# Altium project DB.PRJPCB
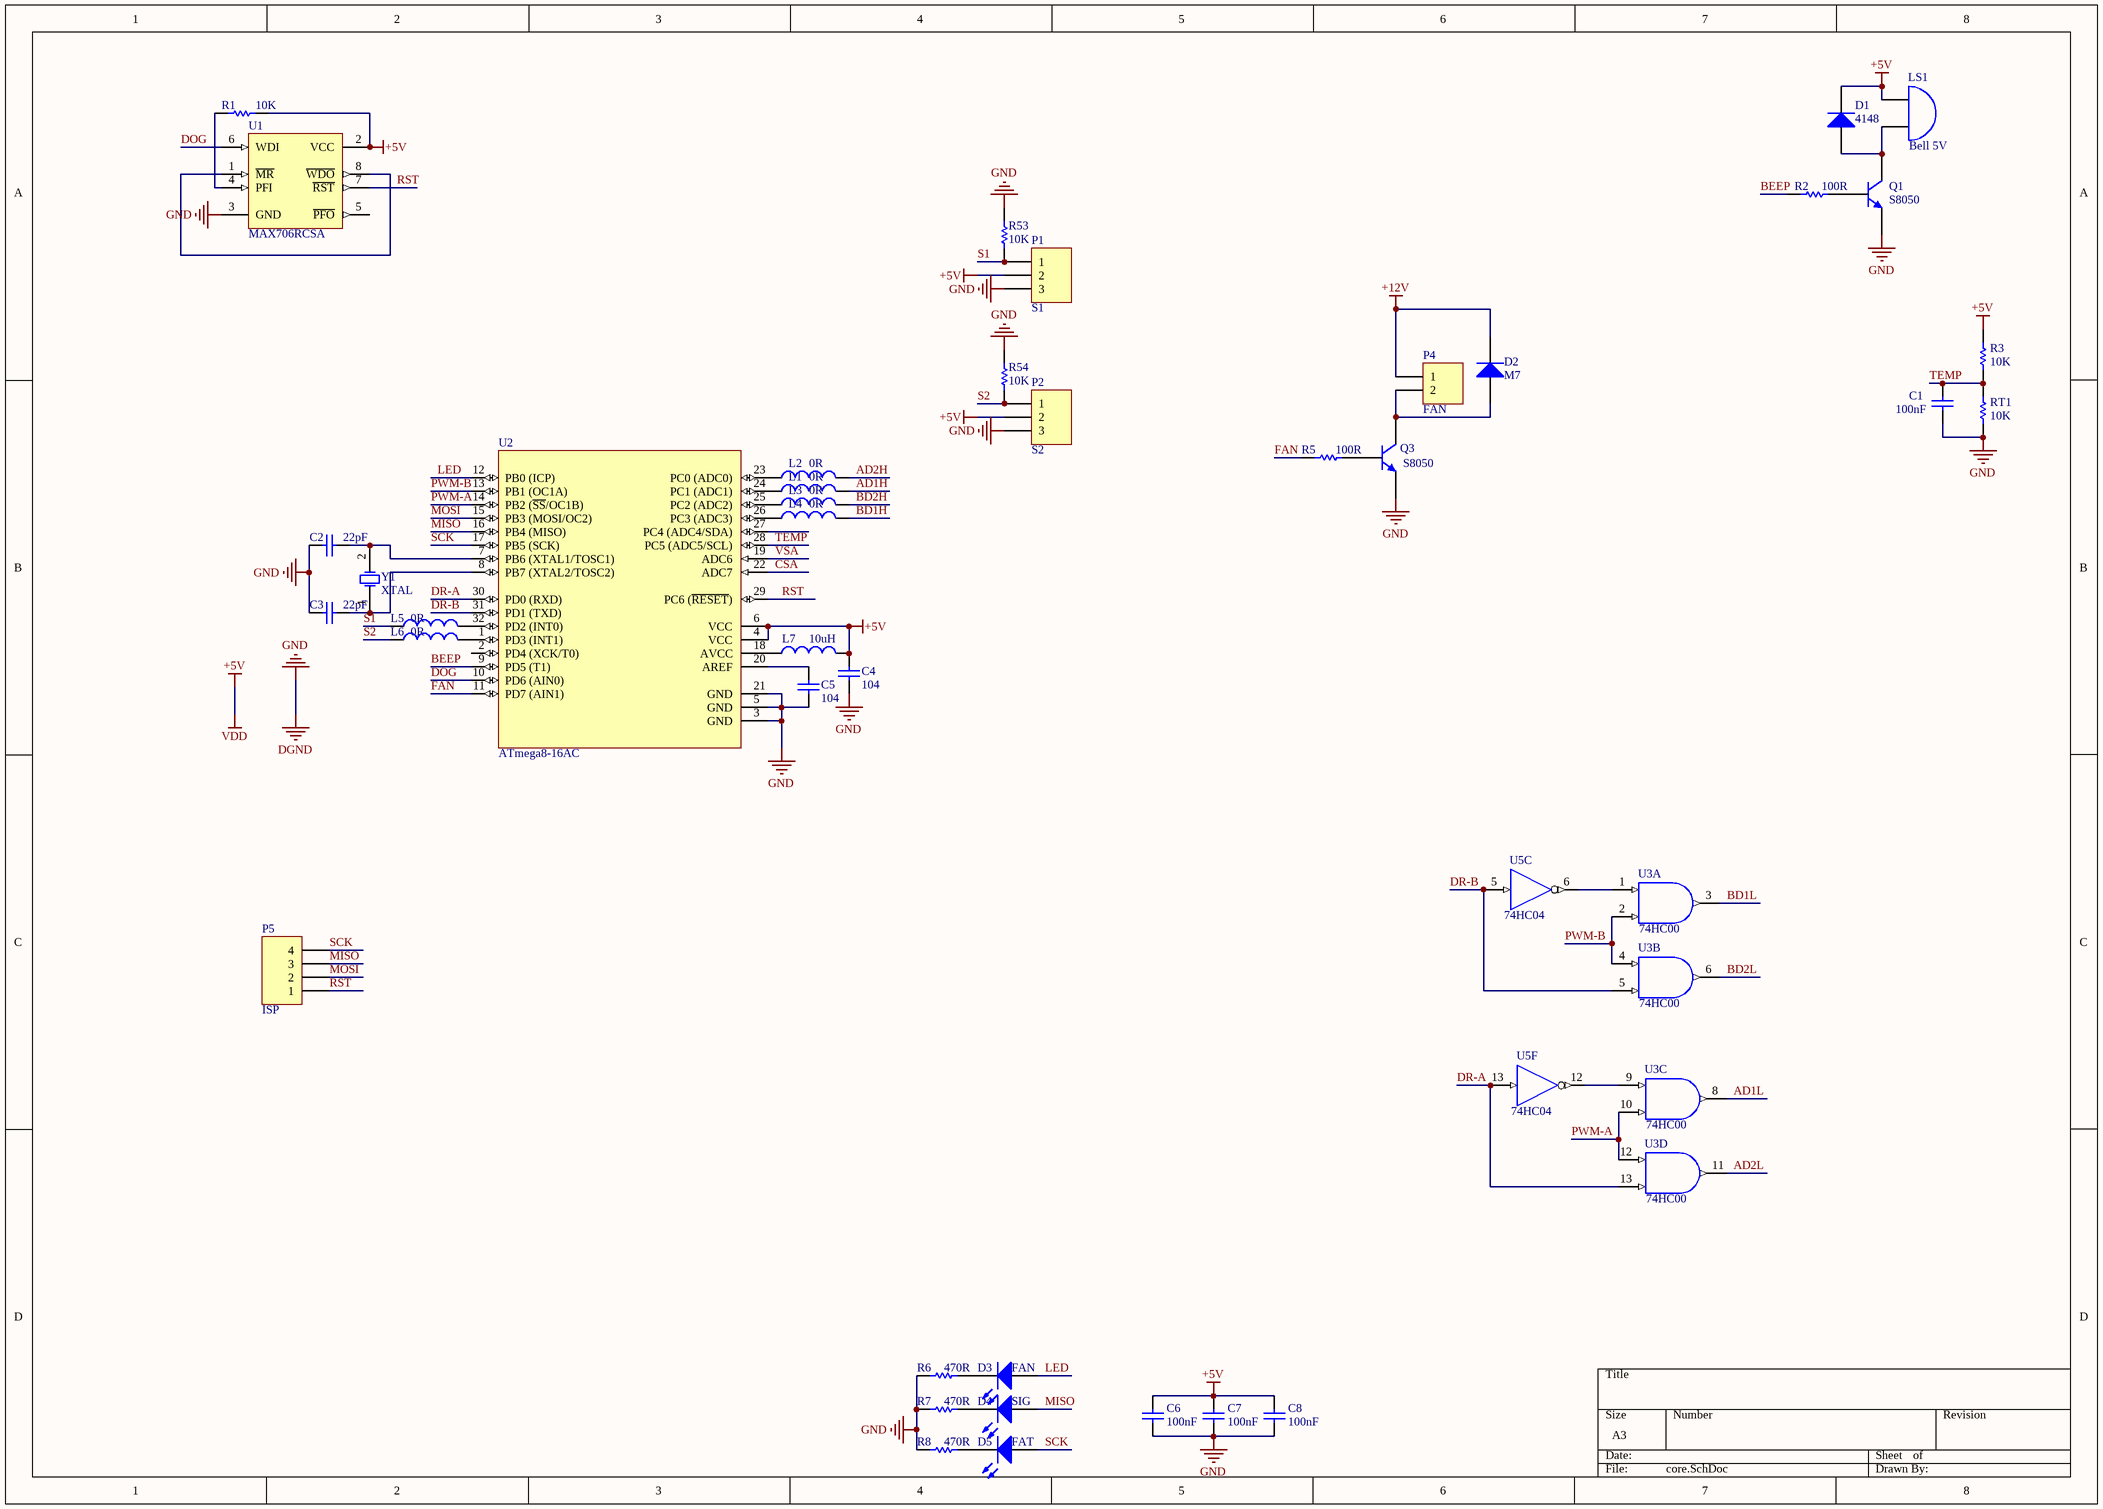
[diagram p0: core.SchDoc]
2 sheets, 151 parts. Net scope: global (net labels, ports and power ports of the same name join across sheets).
Board file: db.PcbDoc
Sheets:
  core.SchDoc
  drive.SchDoc

## Sheet core.SchDoc
size A3

### Parts
C1  value 100nF  [0603]  (hidden comment: Cap)
C2  value 22pF  [0603]  (hidden comment: Cap)
C3  value 22pF  [0603]  (hidden comment: Cap)
C4  value 104  [0603]  (hidden comment: Cap)
C5  value 104  [0603]  (hidden comment: Cap)
C6  value 100nF  [0603]  (hidden comment: Cap)
C7  value 100nF  [0603]  (hidden comment: Cap)
C8  value 100nF  [0603]  (hidden comment: Cap)
D1  4148  [LL34]
D2  value M7  [SMA]  (hidden comment: Diode)
D3  FAN  [0603-LED]
D4  SIG  [0603-LED]
D5  FAT  [0603-LED]
L1  value 0R  [0603]  (hidden comment: Inductor)
L2  value 0R  [0603]  (hidden comment: Inductor)
L3  value 0R  [0603]  (hidden comment: Inductor)
L4  value 0R  [0603]  (hidden comment: Inductor)
L5  value 0R  [0603]  (hidden comment: Inductor)
L6  value 0R  [0603]  (hidden comment: Inductor)
L7  value 10uH  [0603]  (hidden comment: Inductor)
LS1  value Bell 5V  [BEEP-9x5.5]  (hidden comment: Bell)
P1  S1  [HDR1X3]
P2  S2  [HDR1X3]
P4  FAN  [XH2.54-2P]
P5  ISP  [HDR1X4]
Q1  value S8050  [SOT-23-NPN]  (hidden comment: NPN)
Q3  value S8050  [SOT-23-NPN]  (hidden comment: NPN)
R1  value 10K  [0603]  (hidden comment: Res1)
R2  value 100R  [0603]  (hidden comment: Res1)
R3  value 10K  [0603]  (hidden comment: Res1)
R5  value 100R  [0603]  (hidden comment: Res1)
R6  value 470R  [0603]  (hidden comment: Res1)
R7  value 470R  [0603]  (hidden comment: Res1)
R8  value 470R  [0603]  (hidden comment: Res1)
R53  value 10K  [0603]  (hidden comment: Res1)
R54  value 10K  [0603]  (hidden comment: Res1)
RT1  value 10K  [RT-2.0]  (hidden comment: Res1)
U1  MAX706RCSA  [SOIC8]
U2  ATmega8-16AC  [32A_M]
U3  value 74HC00  [751A]  (hidden comment: IC)  (parts A,B,C,D of 4)
U5  value 74HC04  [751A]  (hidden comment: IC)  (parts C,F of 6)
Y1  XTAL  [49SD]

### Nets
+5V: C4.1 C6.2 C7.2 C8.2 D1.2(K) L7.2 LS1.1(A) P1.2 P2.2 R1.2 R3.2 U1.2(VCC) U2.4(VCC) U2.6(VCC) U3.14(VDD) U5.14(VDD)  [also labelled VDD]
+12V: D2.2(K) P4.1
DGND: C1.1 C2.2 C3.2 C4.2 C5.2 C6.1 C7.1 C8.1 P1.3 P2.3 Q1.1(E) Q3.1(E) R6.2 R7.2 R8.2 R53.2 R54.2 RT1.1 U1.3(GND) U2.3(GND) U2.5(GND) U2.21(GND) U3.7(GND) U5.7(GND)  [also labelled GND]
AD1H: L1.2
AD1L: U3.8(Y)
AD2H: L2.2
AD2L: U3.11(Y)
BD1H: L4.2
BD1L: U3.3(Y)
BD2H: L3.2
BD2L: U3.6(Y)
BEEP: R2.2 U2.9(PD5_(T1))
CSA: U2.22(ADC7)
DOG: U1.6(WDI) U2.10(PD6_(AIN0))
DR-A: U2.30(PD0_(RXD)) U3.13(B) U5.13(A)
DR-B: U2.31(PD1_(TXD)) U3.5(B) U5.5(A)
FAN: R5.1 U2.11(PD7_(AIN1))
LED: D3.1(A) U2.12(PB0_(ICP))
MISO: D4.1(A) P5.3 U2.16(PB4_(MISO))
MOSI: P5.2 U2.15(PB3_(MOSI/OC2))
PWM-A: U2.14(PB2_(~{SS}/OC1B)) U3.10(B) U3.12(A)
PWM-B: U2.13(PB1_(OC1A)) U3.2(B) U3.4(A)
RST: P5.1 U1.7(~{RST}) U2.29(PC6_(~{RESET}))
S1: L5.1 P1.1 R53.1
S2: L6.1 P2.1 R54.1
SCK: D5.1(A) P5.4 U2.17(PB5_(SCK))
TEMP: C1.2 R3.1 RT1.2 U2.28(PC5_(ADC5/SCL))
VSA: U2.19(ADC6)
NetC2_1: C2.1 U2.7(PB6_(XTAL1/TOSC1)) Y1.2(OSC2)
NetC3_1: C3.1 U2.8(PB7_(XTAL2/TOSC2)) Y1.1(OSC1)
NetC5_1: C5.1 U2.20(AREF)
NetD1_1: D1.1(A) LS1.2(B) Q1.3(C)
NetD2_1: D2.1(A) P4.2 Q3.3(C)
NetD3_2: D3.2(K) R6.1
NetD4_2: D4.2(K) R7.1
NetD5_2: D5.2(K) R8.1
NetL1_1: L1.1 U2.24(PC1_(ADC1))
NetL2_1: L2.1 U2.23(PC0_(ADC0))
NetL3_1: L3.1 U2.25(PC2_(ADC2))
NetL4_1: L4.1 U2.26(PC3_(ADC3))
NetL5_2: L5.2 U2.32(PD2_(INT0))
NetL6_2: L6.2 U2.1(PD3_(INT1))
NetL7_1: L7.1 U2.18(AVCC)
NetQ1_2: Q1.2(B) R2.1
NetQ3_2: Q3.2(B) R5.2
NetR1_1: R1.1 U1.4(PFI)
NetU1_1: U1.1(~{MR}) U1.8(~{WDO})
NetU3_1: U3.1(A) U5.6(Y)
NetU3_9: U3.9(A) U5.12(Y)

Not connected (* = marked no-connect by the designer): U1 5(~{PFO}); U2 2(PD4_(XCK/T0)) 27(PC4_(ADC4/SDA))

### Library data of the parts
C1-C8 = Cap: Capacitor; Published: 8-Jun-2000; LatestRevisionDate: 17-Jul-2002; LatestRevisionNote: Re-released for DXP Platform.; PackageReference: RAD-0.3; Publisher: Altium Limited
D1 = Diode 1N5408: 3 Amp Medium Power Silicon Rectifier Diode; Value: 1N4148; Published: 8-Jun-2000; LatestRevisionDate: 17-Jul-2002; LatestRevisionNote: Re-released for DXP Platform.; DatasheetDocument: Aug-1984; PackageReference: DO-201AD; Publisher: Altium Limited; ComponentLink1Description: Manufacturer Link; ComponentLink1URL: http://www.irf.com/
D2 = Diode 1N4007: 1 Amp General Purpose Rectifier; Published: 8-Jun-2000; LatestRevisionDate: 17-Jul-2002; LatestRevisionNote: Re-released for DXP Platform.; DatasheetDocument: 1998; PackageDocument: Aug-1999; PackageReference: DO-41; Publisher: Altium Limited; Code_JEDEC: DO-204-AL; ComponentLink1Description: Manufacturer Link; ComponentLink1URL: http://www.fairchildsemi.com/; ComponentLink2Description: Datasheet; ComponentLink2URL: http://www.fairchildsemi.com/ds/1N%2F1N4001.pdf
D3-D5 = LED2: Typical RED, GREEN, YELLOW, AMBER GaAs LED; Published: 8-Jun-2000; LatestRevisionDate: 17-Jul-2002; LatestRevisionNote: Re-released for DXP Platform.; PackageDocument: Feb-2002; PackageReference: 3.2X1.6X1.1; Publisher: Altium Limited; Value: RED
L1-L7 = Inductor: Code_IEC: 1005; Published: 8-Jun-2000; LatestRevisionDate: 17-Jul-2002; LatestRevisionNote: Re-released for DXP Platform.; PackageReference: 0402-A; Publisher: Altium Limited; Code_JEITA: 0402
LS1 = Bell: Electrical Bell; pin to pad: 1>2 2>1; Published: 24-Mar-1999; LatestRevisionDate: 17-Jul-2002; LatestRevisionNote: Re-released for DXP Platform.; PackageReference: PIN2; Publisher: Altium Limited
P1 P2 = Header 3: Header, 3-Pin; LatestRevisionDate: 17-Jul-2002; LatestRevisionNote: Re-released for DXP Platform.; Publisher: Altium Limited
P4 = Header 2: Header, 2-Pin; Value: XH2.54-2P; LatestRevisionDate: 17-Jul-2002; LatestRevisionNote: Re-released for DXP Platform.; Publisher: Altium Limited
P5 = Header 4: Header, 4-Pin; LatestRevisionDate: 17-Jul-2002; LatestRevisionNote: Re-released for DXP Platform.; Publisher: Altium Limited
Q1 Q3 = 2N5551: NPN General Purpose Amplifier; Published: 8-Jun-2000; LatestRevisionDate: 17-Jan-2003; LatestRevisionNote: PCB Footprint 'BCY-W3/D4.7' replaced; DatasheetDocument: 1997; PackageDocument: Sep-1998; PackageReference: TO-92A; Publisher: Altium Limited; ComponentLink1Description: Manufacturer Link; ComponentLink1URL: http://www.fairchildsemi.com/; ComponentLink2Description: Datasheet; ComponentLink2URL: http://www.fairchildsemi.com/ds/2N%2F2N5551.pdf
R1-R3 R5-R8 R53 R54 RT1 = Res1: Resistor; Published: 8-Jun-2000; LatestRevisionDate: 17-Jul-2002; LatestRevisionNote: Re-released for DXP Platform.; PackageReference: AXIAL-0.3; Publisher: Altium Limited
U1 = MAX706RCSA: +3V Voltage Monitoring, Low-Cost, µP Supervisory Circuit; Published: 16-Jan-2001; LatestRevisionDate: 13-Apr-2006; LatestRevisionNote: IPC-7351 Footprint Added.; DatasheetVersion: Sep-1995; PackageReference: NSO8; Publisher: Altium Limited; PackageDescription: 8-Pin Small Outline Integrated Circuit 1.27 mm Pitch; Code_JEDEC: MS-012-AA; Code_IPC: SOIC127P600-8; ComponentLink1Description: Manufacturer Link; ComponentLink1URL: http://www.maxim-ic.com/; ComponentLink2Description: Datasheet; ComponentLink2URL: http://pdfserv.maxim-ic.com/en/ds/MAX706P-MAX708T.pdf
U2 = ATmega8-16AC: 8-Bit AVR Microcontroller with 8K Bytes of In-System Programmable Flash Memory; Published: 17-Sep-2003; LatestRevisionDate: 13-Apr-2006; LatestRevisionNote: IPC-7351 Footprint Added.; DatasheetVersion: 2486H-AVR-09/02; PackageVersion: revB, Oct-2001; PackageReference: 32A; Publisher: Altium Limited; PackageDescription: 32-Pin Thin Quad Flat Pack 0.8 mm Pitch; Code_JEDEC: MS-026-ABA; ComponentLink1Description: Manufacturer Link; ComponentLink1URL: http://www.atmel.com; ComponentLink2Description: Datasheet; ComponentLink2URL: http://www.atmel.com/dyn/resources/prod_documents/doc2486.pdf
U3 = MC74HC08AD: Quad 2-Input AND Gate; Published: 17-Jul-2002; LatestRevisionDate: 13-Apr-2006; LatestRevisionNote: IPC-7351 Footprint Added.; DatasheetVersion: 1989; PackageVersion: 1991; PackageReference: 751A-02; Publisher: Altium Limited; PackageDescription: 14-Pin Small Outline Integrated Circuit 1.27 mm Pitch; Code_IPC: SOIC127P600-14; ComponentLink1Description: Manufacturer Link; ComponentLink1URL: http://www.onsemi.com/site/products/parametrics/0,4446,247,00.html; ComponentLink2Description: Ibis Model; ComponentLink2URL: http://www.onsemi.com/pub/Collateral/MC54HC08AJ.IBS
U5 = MC74HC04AD: Hex Inverter; Published: 17-Jul-2002; LatestRevisionDate: 13-Apr-2006; LatestRevisionNote: IPC-7351 Footprint Added.; DatasheetVersion: 1989; PackageVersion: 1991; PackageReference: 751A-02; Publisher: Altium Limited; PackageDescription: 14-Pin Small Outline Integrated Circuit 1.27 mm Pitch; Code_IPC: SOIC127P600-14; ComponentLink1Description: Manufacturer Link; ComponentLink1URL: http://www.onsemi.com/site/products/parametrics/0,4446,247,00.html; ComponentLink2Description: Ibis Model; ComponentLink2URL: http://www.onsemi.com/pub/Collateral/MC54HC04AJ.IBS
Y1 = XTAL: Crystal Oscillator; Published: 8-Jun-2000; LatestRevisionDate: 17-Jul-2002; LatestRevisionNote: Re-released for DXP Platform.; PackageReference: R38; Publisher: Altium Limited

## Sheet drive.SchDoc
size A3
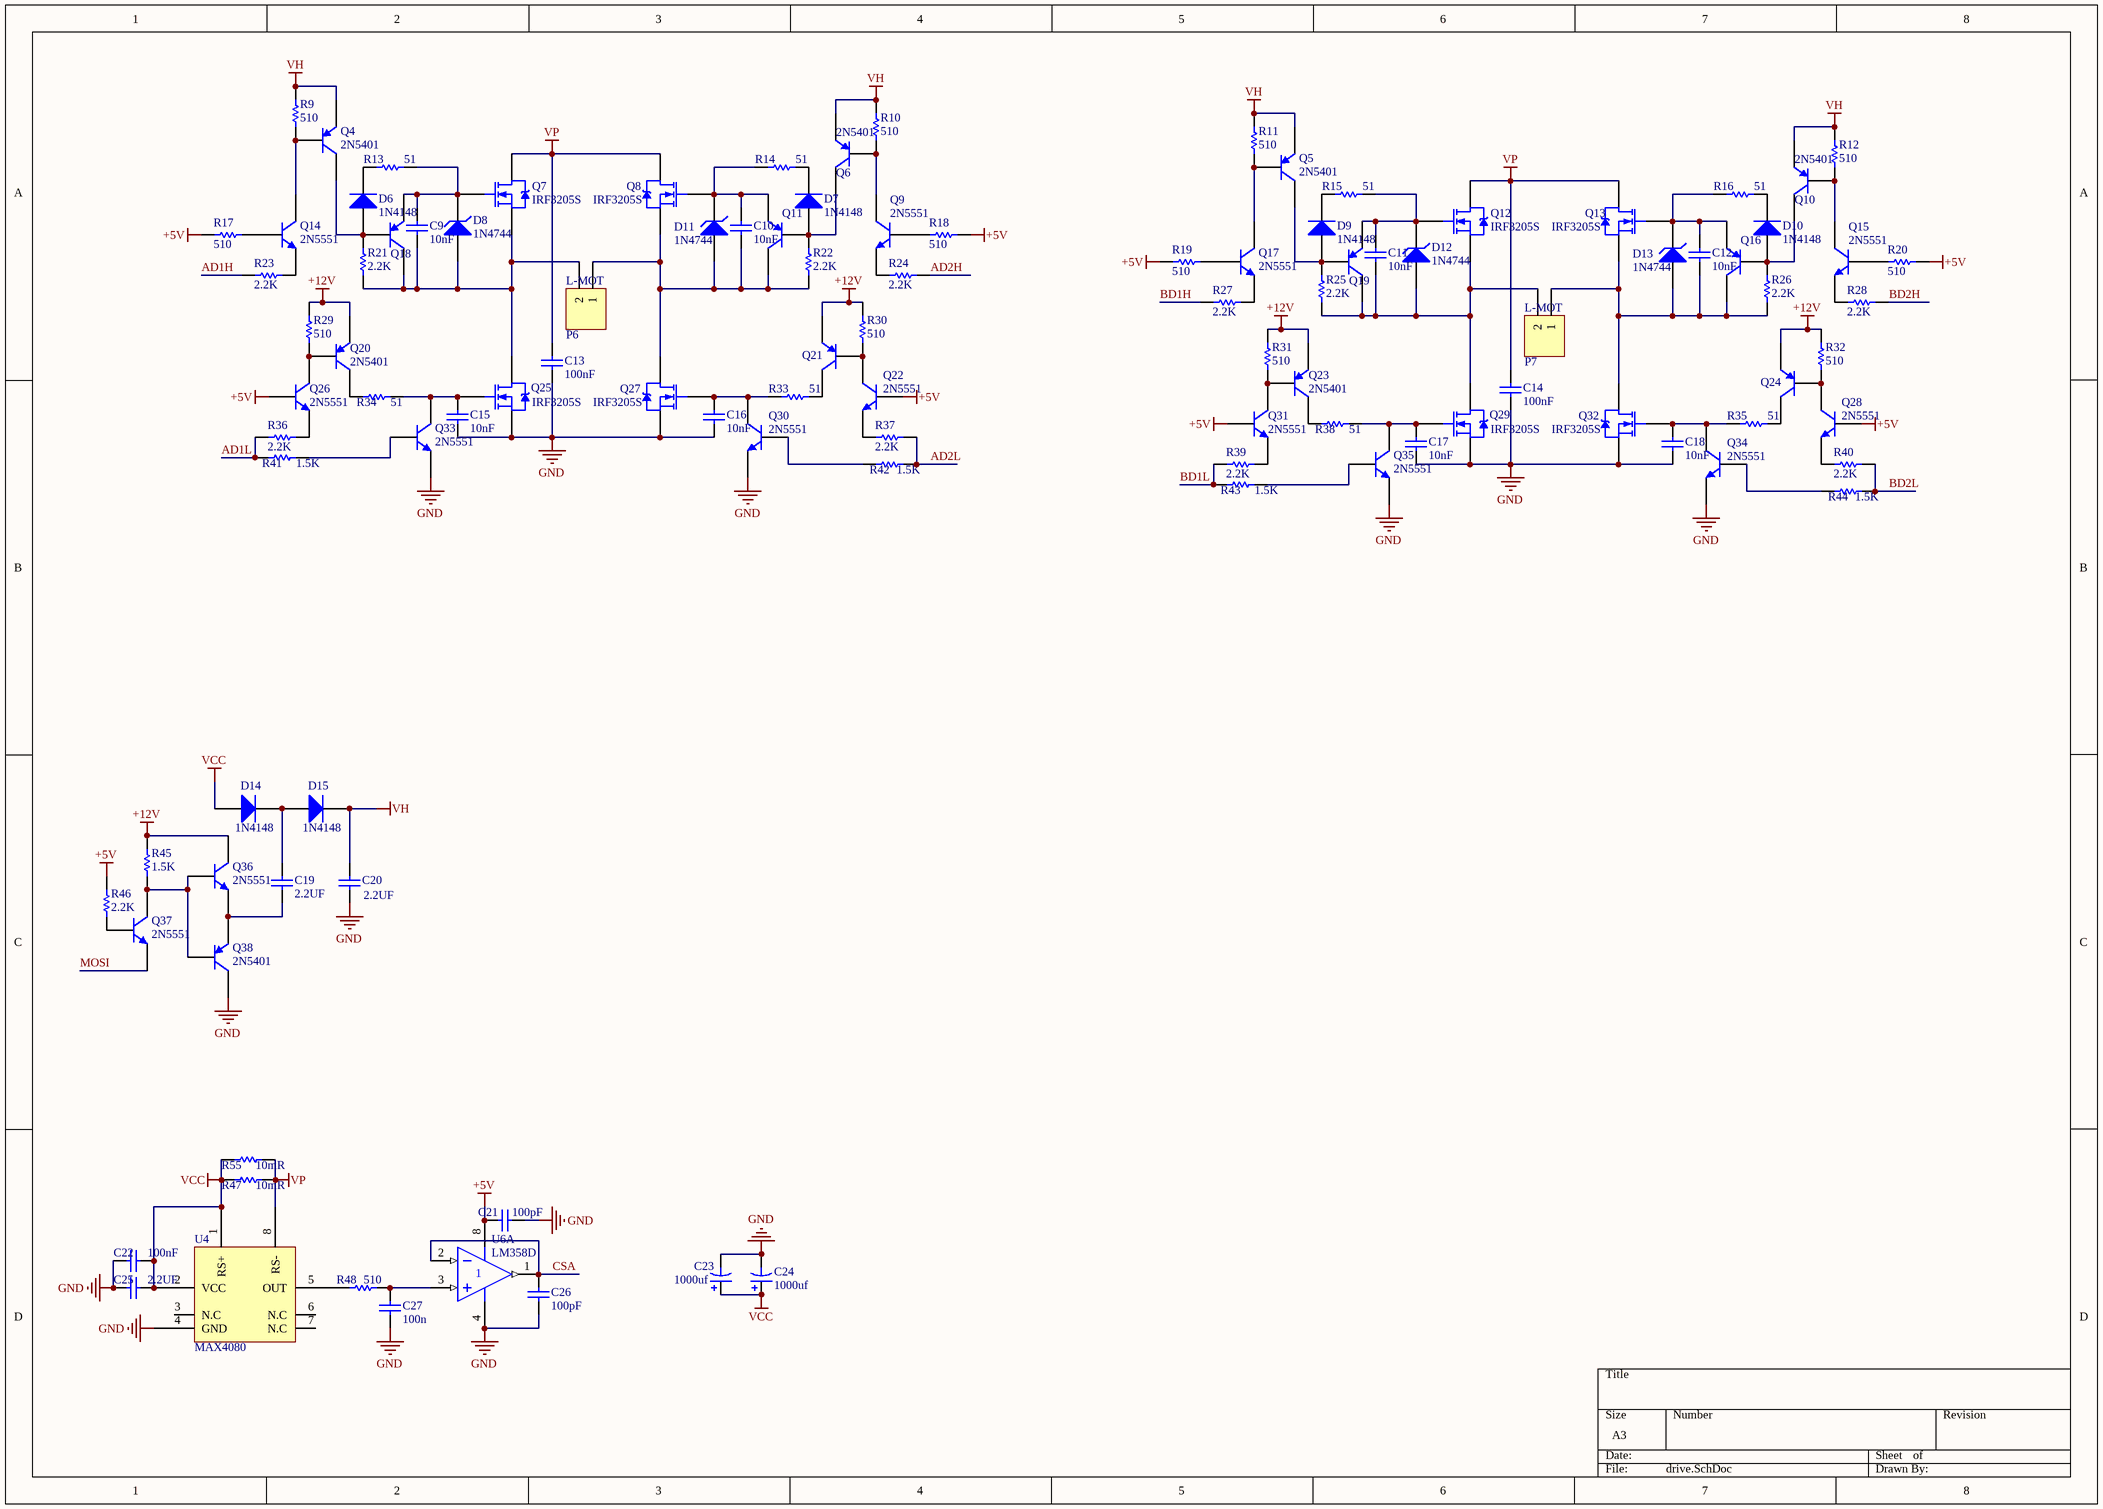
[diagram p1: drive.SchDoc]

### Parts
C9  value 10nF  [0603]  (hidden comment: Cap)
C10  value 10nF  [0603]  (hidden comment: Cap)
C11  value 10nF  [0603]  (hidden comment: Cap)
C12  value 10nF  [0603]  (hidden comment: Cap)
C13  value 100nF  [3216[1206]]  (hidden comment: Cap)
C14  value 100nF  [3216[1206]]  (hidden comment: Cap)
C15  value 10nF  [0603]  (hidden comment: Cap)
C16  value 10nF  [0603]  (hidden comment: Cap)
C17  value 10nF  [0603]  (hidden comment: Cap)
C18  value 10nF  [0603]  (hidden comment: Cap)
C19  value 2.2UF  [C1206]  (hidden comment: Cap)
C20  value 2.2UF  [C1206]  (hidden comment: Cap)
C21  value 100pF  [0603]  (hidden comment: Cap)
C22  value 100nF  [0603]  (hidden comment: Cap)
C23  value 1000uf  [C16-7.5]  (hidden comment: Cap Pol1)
C24  value 1000uf  [C16-7.5]  (hidden comment: Cap Pol1)
C25  value 2.2UF  [3216[1206]]  (hidden comment: Cap)
C26  value 100pF  [0603]  (hidden comment: Cap)
C27  value 100n  [0603]  (hidden comment: Cap)
D6  1N4148  [LL34]
D7  1N4148  [LL34]
D8  1N4744  [LL34]
D9  1N4148  [LL34]
D10  1N4148  [LL34]
D11  1N4744  [LL34]
D12  1N4744  [LL34]
D13  1N4744  [LL34]
D14  value 1N4148  [LL34]  (hidden comment: Diode)
D15  value 1N4148  [LL34]  (hidden comment: Diode)
P6  L-MOT  [MG7.62-2P]
P7  L-MOT  [MG7.62-2P]
Q4  2N5401  [SOT-23-PNP]
Q5  2N5401  [SOT-23-PNP]
Q6  2N5401  [SOT-23-PNP]
Q7  IRF3205S  [D2PAK-263]
Q8  IRF3205S  [D2PAK-263]
Q9  2N5551  [SOT-23-NPN]
Q10  2N5401  [SOT-23-PNP]
Q11  2N5401  [SOT-23-PNP]  (value not drawn)
Q12  IRF3205S  [D2PAK-263]
Q13  IRF3205S  [D2PAK-263]
Q14  2N5551  [SOT-23-NPN]
Q15  2N5551  [SOT-23-NPN]
Q16  2N5401  [SOT-23-PNP]  (value not drawn)
Q17  2N5551  [SOT-23-NPN]
Q18  2N5401  [SOT-23-PNP]  (value not drawn)
Q19  2N5401  [SOT-23-PNP]  (value not drawn)
Q20  2N5401  [SOT-23-PNP]
Q21  2N5401  [SOT-23-PNP]  (value not drawn)
Q22  2N5551  [SOT-23-NPN]
Q23  2N5401  [SOT-23-PNP]
Q24  2N5401  [SOT-23-PNP]  (value not drawn)
Q25  IRF3205S  [D2PAK-263]
Q26  2N5551  [SOT-23-NPN]
Q27  IRF3205S  [D2PAK-263]
Q28  2N5551  [SOT-23-NPN]
Q29  IRF3205S  [D2PAK-263]
Q30  2N5551  [SOT-23-NPN]
Q31  2N5551  [SOT-23-NPN]
Q32  IRF3205S  [D2PAK-263]
Q33  2N5551  [SOT-23-NPN]
Q34  2N5551  [SOT-23-NPN]
Q35  2N5551  [SOT-23-NPN]
Q36  value 2N5551  [SOT-23-NPN]  (hidden comment: NPN)
Q37  value 2N5551  [SOT-23-NPN]  (hidden comment: NPN)
Q38  value 2N5401  [SOT-23-PNP]  (hidden comment: PNP)
R9  value 510  [0603]  (hidden comment: Res1)
R10  value 510  [0603]  (hidden comment: Res1)
R11  value 510  [0603]  (hidden comment: Res1)
R12  value 510  [0603]  (hidden comment: Res1)
R13  value 51  [0603]  (hidden comment: Res1)
R14  value 51  [0603]  (hidden comment: Res1)
R15  value 51  [0603]  (hidden comment: Res1)
R16  value 51  [0603]  (hidden comment: Res1)
R17  value 510  [0603]  (hidden comment: Res1)
R18  value 510  [0603]  (hidden comment: Res1)
R19  value 510  [0603]  (hidden comment: Res1)
R20  value 510  [0603]  (hidden comment: Res1)
R21  value 2.2K  [0603]  (hidden comment: Res1)
R22  value 2.2K  [0603]  (hidden comment: Res1)
R23  value 2.2K  [0603]  (hidden comment: Res1)
R24  value 2.2K  [0603]  (hidden comment: Res1)
R25  value 2.2K  [0603]  (hidden comment: Res1)
R26  value 2.2K  [0603]  (hidden comment: Res1)
R27  value 2.2K  [0603]  (hidden comment: Res1)
R28  value 2.2K  [0603]  (hidden comment: Res1)
R29  value 510  [0603]  (hidden comment: Res1)
R30  value 510  [0603]  (hidden comment: Res1)
R31  value 510  [0603]  (hidden comment: Res1)
R32  value 510  [0603]  (hidden comment: Res1)
R33  value 51  [0603]  (hidden comment: Res1)
R34  value 51  [0603]  (hidden comment: Res1)
R35  value 51  [0603]  (hidden comment: Res1)
R36  value 2.2K  [0603]  (hidden comment: Res1)
R37  value 2.2K  [0603]  (hidden comment: Res1)
R38  value 51  [0603]  (hidden comment: Res1)
R39  value 2.2K  [0603]  (hidden comment: Res1)
R40  value 2.2K  [0603]  (hidden comment: Res1)
R41  value 1.5K  [0603]  (hidden comment: Res1)
R42  value 1.5K  [0603]  (hidden comment: Res1)
R43  value 1.5K  [0603]  (hidden comment: Res1)
R44  value 1.5K  [0603]  (hidden comment: Res1)
R45  value 1.5K  [0603]  (hidden comment: Res1)
R46  value 2.2K  [0603]  (hidden comment: Res1)
R47  value 10mR  [R15-1mm]
R48  value 510  [0603]  (hidden comment: Res1)
R55  value 10mR  [R15-1mm]
U4  MAX4080  [SOIC8]
U6  LM358D  [SOIC8]  (part A of 2)

### Nets
+5V: C21.2 Q22.2(B) Q26.2(B) Q28.2(B) Q31.2(B) R17.2 R18.2 R19.2 R20.2 R46.2 U6.8(V+)
+12V: Q20.1(E) Q21.1(E) Q23.1(E) Q24.1(E) Q36.3(C) R29.1 R30.1 R31.1 R32.1 R45.2
GND: C13.2 C14.2 C15.2 C16.2 C17.2 C18.2 C20.1 C21.1 C22.1 C23.2 C24.2 C25.2 C26.1 C27.1 Q25.3(S) Q27.3(S) Q29.3(S) Q30.1(E) Q32.3(S) Q33.1(E) Q34.1(E) Q35.1(E) Q38.3(C) U4.4(GND) U6.4(V-)  [project net DGND]
VCC: C22.2 C23.1 C24.1 C25.1 D14.1(A) R47.2 R55.2 U4.1(RS+) U4.2(VCC)
VH: C20.2 D15.2(K) Q4.1(E) Q5.1(E) Q6.1(E) Q10.1(E) R9.1 R10.1 R11.1 R12.1
VP: C13.1 C14.1 Q7.2(D) Q8.2(D) Q12.2(D) Q13.2(D) R47.1 R55.1 U4.8(RS-)
AD1H: R23.1
AD1L: R36.1 R41.2
AD2H: R24.2
AD2L: R37.2 R42.1
BD1H: R27.1
BD1L: R39.1 R43.2
BD2H: R28.2
BD2L: R40.2 R44.1
CSA: C26.2 U6.1(OUT) U6.2(IN-)
MOSI: Q37.1(E)
NetC9_1: C9.1 D8.2(K) Q7.1(G) Q18.1(E) R13.2
NetC9_2: C9.2 D8.1(A) P6.2 Q7.3(S) Q18.3(C) Q25.2(D) R21.1
NetC10_1: C10.1 D11.2(K) Q8.1(G) Q11.1(E) R14.1
NetC10_2: C10.2 D11.1(A) P6.1 Q8.3(S) Q11.3(C) Q27.2(D) R22.1
NetC11_1: C11.1 D12.2(K) Q12.1(G) Q19.1(E) R15.2
NetC11_2: C11.2 D12.1(A) P7.2 Q12.3(S) Q19.3(C) Q29.2(D) R25.1
NetC12_1: C12.1 D13.2(K) Q13.1(G) Q16.1(E) R16.1
NetC12_2: C12.2 D13.1(A) P7.1 Q13.3(S) Q16.3(C) Q32.2(D) R26.1
NetC15_1: C15.1 Q25.1(G) Q33.3(C) R34.2
NetC16_1: C16.1 Q27.1(G) Q30.3(C) R33.1
NetC17_1: C17.1 Q29.1(G) Q35.3(C) R38.2
NetC18_1: C18.1 Q32.1(G) Q34.3(C) R35.1
NetC19_1: C19.1 D14.2(K) D15.1(A)
NetC19_2: C19.2 Q36.1(E) Q38.1(E)
NetC27_2: C27.2 R48.1 U6.3(IN+)
NetD6_1: D6.1(A) Q4.3(C) Q18.2(B) R21.2
NetD6_2: D6.2(K) R13.1
NetD7_1: D7.1(A) Q6.3(C) Q11.2(B) R22.2
NetD7_2: D7.2(K) R14.2
NetD9_1: D9.1(A) Q5.3(C) Q19.2(B) R25.2
NetD9_2: D9.2(K) R15.1
NetD10_1: D10.1(A) Q10.3(C) Q16.2(B) R26.2
NetD10_2: D10.2(K) R16.2
NetQ4_2: Q4.2(B) Q14.3(C) R9.2
NetQ5_2: Q5.2(B) Q17.3(C) R11.2
NetQ6_2: Q6.2(B) Q9.3(C) R10.2
NetQ9_1: Q9.1(E) R24.1
NetQ9_2: Q9.2(B) R18.1
NetQ10_2: Q10.2(B) Q15.3(C) R12.2
NetQ14_1: Q14.1(E) R23.2
NetQ14_2: Q14.2(B) R17.1
NetQ15_1: Q15.1(E) R28.1
NetQ15_2: Q15.2(B) R20.1
NetQ17_1: Q17.1(E) R27.2
NetQ17_2: Q17.2(B) R19.1
NetQ20_2: Q20.2(B) Q26.3(C) R29.2
NetQ20_3: Q20.3(C) R34.1
NetQ21_2: Q21.2(B) Q22.3(C) R30.2
NetQ21_3: Q21.3(C) R33.2
NetQ22_1: Q22.1(E) R37.1
NetQ23_2: Q23.2(B) Q31.3(C) R31.2
NetQ23_3: Q23.3(C) R38.1
NetQ24_2: Q24.2(B) Q28.3(C) R32.2
NetQ24_3: Q24.3(C) R35.2
NetQ26_1: Q26.1(E) R36.2
NetQ28_1: Q28.1(E) R40.1
NetQ30_2: Q30.2(B) R42.2
NetQ31_1: Q31.1(E) R39.2
NetQ33_2: Q33.2(B) R41.1
NetQ34_2: Q34.2(B) R44.2
NetQ35_2: Q35.2(B) R43.1
NetQ36_2: Q36.2(B) Q37.3(C) Q38.2(B) R45.1
NetQ37_2: Q37.2(B) R46.1
NetR48_2: R48.2 U4.5(OUT)

Not connected (* = marked no-connect by the designer): U4 3(N.C) 6(N.C) 7(N.C)

### Library data of the parts
C9-C22 C25-C27 = Cap: Capacitor; Published: 8-Jun-2000; LatestRevisionDate: 17-Jul-2002; LatestRevisionNote: Re-released for DXP Platform.; PackageReference: RAD-0.3; Publisher: Altium Limited
C23 C24 = Cap Pol1: Polarized Capacitor (Radial); Published: 8-Jun-2000; LatestRevisionDate: 17-Jul-2002; LatestRevisionNote: Re-released for DXP Platform.; PackageReference: RB7.6-15; Publisher: Altium Limited
D6 D7 D9 D10 = Diode 1N4148: High Conductance Fast Diode; Published: 8-Jun-2000; LatestRevisionDate: 17-Jul-2002; LatestRevisionNote: Re-released for DXP Platform.; DatasheetDocument: 1997; PackageReference: DO-35; Publisher: Altium Limited; Code_JEDEC: DO-204-AH; ComponentLink1Description: Manufacturer Link; ComponentLink1URL: http://www.fairchildsemi.com/; ComponentLink2Description: Datasheet; ComponentLink2URL: http://www.fairchildsemi.com/ds/1N%2F1N4148.pdf
D8 D11-D13 = D Zener: Zener Diode; Published: 8-Jun-2000; LatestRevisionDate: 17-Jul-2002; LatestRevisionNote: Re-released for DXP Platform.; PackageReference: DIODE-0.7; Publisher: Altium Limited
D14 D15 = Diode 1N5408: 3 Amp Medium Power Silicon Rectifier Diode; Published: 8-Jun-2000; LatestRevisionDate: 17-Jul-2002; LatestRevisionNote: Re-released for DXP Platform.; DatasheetDocument: Aug-1984; PackageReference: DO-201AD; Publisher: Altium Limited; ComponentLink1Description: Manufacturer Link; ComponentLink1URL: http://www.irf.com/
P6 P7 = Header 2: Header, 2-Pin; LatestRevisionDate: 17-Jul-2002; LatestRevisionNote: Re-released for DXP Platform.; Publisher: Altium Limited
Q4-Q6 Q10 Q11 Q16 Q18-Q21 Q23 Q24 Q38 = 2N5401: PNP General Purpose Amplifier; Published: 8-Jun-2000; LatestRevisionDate: 17-Jan-2003; LatestRevisionNote: PCB Footprint 'BCY-W3/D4.7' replaced; DatasheetDocument: 1997; PackageDocument: Sep-1998; PackageReference: TO-92A; Publisher: Altium Limited; ComponentLink1Description: Manufacturer Link; ComponentLink1URL: http://www.fairchildsemi.com/; ComponentLink2Description: Datasheet; ComponentLink2URL: http://www.fairchildsemi.com/ds/2N%2F2N5401.pdf
Q7 Q8 Q12 Q13 Q25 Q27 Q29 Q32 = IRF3205S: HEXFET Power MOSFET; Published: 8-Jun-2000; LatestRevisionDate: 17-Jul-2002; LatestRevisionNote: Re-released for DXP Platform.; DatasheetVersion: Aug-1997; PackageReference: D2PAK; Publisher: Altium Limited; PackageDescription: D2-PAK/TO-263-AB; 3 Leads (1 Cropped); Body 15.5 (inc. leads) x 10.5 mm (LxW max); ComponentLink1Description: Manufacturer Link; ComponentLink1URL: http://www.irf.com/; ComponentLink2Description: Datasheet; ComponentLink2URL: http://www.irf.com/product-info/datasheets/data/irf3205s.pdf
Q9 Q14 Q15 Q17 Q22 Q26 Q28 Q30 Q31 Q33-Q37 = 2N5551: NPN General Purpose Amplifier; Published: 8-Jun-2000; LatestRevisionDate: 17-Jan-2003; LatestRevisionNote: PCB Footprint 'BCY-W3/D4.7' replaced; DatasheetDocument: 1997; PackageDocument: Sep-1998; PackageReference: TO-92A; Publisher: Altium Limited; ComponentLink1Description: Manufacturer Link; ComponentLink1URL: http://www.fairchildsemi.com/; ComponentLink2Description: Datasheet; ComponentLink2URL: http://www.fairchildsemi.com/ds/2N%2F2N5551.pdf
R9-R48 R55 = Res1: Resistor; Published: 8-Jun-2000; LatestRevisionDate: 17-Jul-2002; LatestRevisionNote: Re-released for DXP Platform.; PackageReference: AXIAL-0.3; Publisher: Altium Limited
U6 = LM358D: Dual Low-Power Operational Amplifier; Published: 17-Jul-2002; LatestRevisionDate: 13-Apr-2006; LatestRevisionNote: IPC-7351 Footprint Added.; DatasheetVersion: 1988; PackageReference: 751-02; Publisher: Altium Limited; PackageDescription: 8-Pin Small Outline Integrated Circuit 1.27 mm Pitch; Code_JEDEC: MS-012-AA; Code_IPC: SOIC127P600-8; ComponentLink1Description: Manufacturer Link; ComponentLink1URL: http://www.onsemi.com/site/products/parametrics/0,4446,251,00.html; ComponentLink2Description: Datasheet; ComponentLink2URL: http://www.onsemi.com/pub/Collateral/LM358-D.PDF

## Nets that join several sheets
+5V: core (16 pins), drive (11 pins)
+12V: core (D2.2 P4.1), drive (10 pins)
DGND: core (24 pins), drive (25 pins)
AD1H: core (L1.2), drive (R23.1)
AD1L: core (U3.8), drive (R36.1 R41.2)
AD2H: core (L2.2), drive (R24.2)
AD2L: core (U3.11), drive (R37.2 R42.1)
BD1H: core (L4.2), drive (R27.1)
BD1L: core (U3.3), drive (R39.1 R43.2)
BD2H: core (L3.2), drive (R28.2)
BD2L: core (U3.6), drive (R40.2 R44.1)
CSA: core (U2.22), drive (C26.2 U6.1 U6.2)
MOSI: core (P5.2 U2.15), drive (Q37.1)